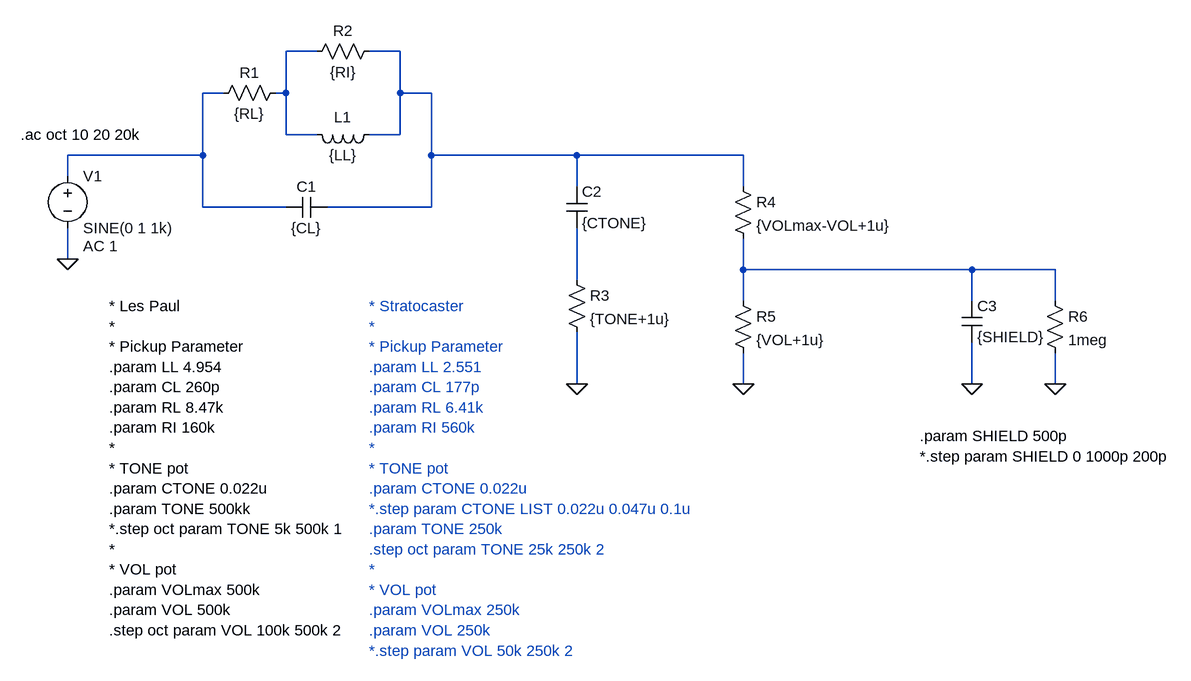
[diagram p0: schematic Pickup.asc]
Pickup.asc, the LTspice schematic file:
Version 4
SHEET 1 1312 1076
WIRE -80 -112 -128 -112
WIRE 48 -112 0 -112
WIRE -224 -48 -256 -48
WIRE -128 -48 -128 -112
WIRE -128 -48 -144 -48
WIRE 48 -48 48 -112
WIRE 96 -48 48 -48
WIRE -128 16 -128 -48
WIRE -80 16 -128 16
WIRE 48 16 48 -48
WIRE 48 16 0 16
WIRE -256 48 -256 -48
WIRE -256 48 -464 48
WIRE 96 48 96 -48
WIRE 320 48 96 48
WIRE 576 48 320 48
WIRE -464 80 -464 48
WIRE 320 96 320 48
WIRE 576 96 576 48
WIRE -256 128 -256 48
WIRE -128 128 -256 128
WIRE 96 128 96 48
WIRE 96 128 -64 128
WIRE -464 208 -464 160
WIRE 576 224 576 176
WIRE 928 224 576 224
WIRE 1056 224 928 224
WIRE 320 240 320 160
WIRE 576 272 576 224
WIRE 928 272 928 224
WIRE 1056 272 1056 224
WIRE 320 400 320 320
WIRE 576 400 576 352
WIRE 928 400 928 336
WIRE 1056 400 1056 352
FLAG -464 208 0
FLAG 320 400 0
FLAG 576 400 0
FLAG 1056 400 0
FLAG 928 400 0
SYMBOL res -128 -64 R90
WINDOW 0 0 56 VBottom 2
WINDOW 3 32 56 VTop 2
SYMATTR InstName R1
SYMATTR Value {RL}
SYMBOL res 16 -128 R90
WINDOW 0 0 56 VBottom 2
WINDOW 3 32 56 VTop 2
SYMATTR InstName R2
SYMATTR Value {RI}
SYMBOL ind 16 0 R90
WINDOW 0 5 56 VBottom 2
WINDOW 3 32 56 VTop 2
SYMATTR InstName L1
SYMATTR Value {LL}
SYMBOL cap -64 112 R90
WINDOW 0 0 32 VBottom 2
WINDOW 3 32 32 VTop 2
SYMATTR InstName C1
SYMATTR Value {CL}
SYMBOL voltage -464 64 R0
WINDOW 123 24 124 Left 2
WINDOW 39 0 0 Left 2
SYMATTR Value2 AC 1
SYMATTR InstName V1
SYMATTR Value SINE(0 1 1k)
SYMBOL res 304 224 R0
SYMATTR InstName R3
SYMATTR Value {TONE+1u}
SYMBOL cap 304 96 R0
SYMATTR InstName C2
SYMATTR Value {CTONE}
SYMBOL res 560 80 R0
SYMATTR InstName R4
SYMATTR Value {VOLmax-VOL+1u}
SYMBOL res 560 256 R0
SYMATTR InstName R5
SYMATTR Value {VOL+1u}
SYMBOL cap 912 272 R0
SYMATTR InstName C3
SYMATTR Value {SHIELD}
SYMBOL res 1040 256 R0
SYMATTR InstName R6
SYMATTR Value 1meg
TEXT -536 16 Left 2 !.ac oct 10 20 20k
TEXT 848 480 Left 2 !.param SHIELD 500p\n*.step param SHIELD 0 1000p 200p
TEXT 0 280 Left 2 ;* Stratocaster\n*\n* Pickup Parameter\n.param LL 2.551\n.param CL 177p\n.param RL 6.41k\n.param RI 560k\n*\n* TONE pot\n.param CTONE 0.022u\n*.step param CTONE LIST 0.022u 0.047u 0.1u\n.param TONE 250k\n.step oct param TONE 25k 250k 2\n*\n* VOL pot\n.param VOLmax 250k\n.param VOL 250k\n*.step param VOL 50k 250k 2
TEXT -400 280 Left 2 !* Les Paul\n*\n* Pickup Parameter\n.param LL 4.954\n.param CL 260p\n.param RL 8.47k\n.param RI 160k\n*\n* TONE pot\n.param CTONE 0.022u\n.param TONE 500kk\n*.step oct param TONE 5k 500k 1\n*\n* VOL pot\n.param VOLmax 500k\n.param VOL 500k\n.step oct param VOL 100k 500k 2

The netlist it stands for:
* Pickup.asc
R1 N001 N003 {RL}
R2 N002 N001 {RI}
L1 N002 N001 {LL}
C1 N002 N003 {CL}
V1 N003 0 SINE(0 1 1k) AC 1
R3 N005 0 {TONE+1u}
C2 N002 N005 {CTONE}
R4 N002 N004 {VOLmax-VOL+1u}
R5 N004 0 {VOL+1u}
C3 N004 0 {SHIELD}
R6 N004 0 1meg
.ac oct 10 20 20k
.param SHIELD 500p
*.step param SHIELD 0 1000p 200p
* * Stratocaster
* *
* * Pickup Parameter
* .param LL 2.551
* .param CL 177p
* .param RL 6.41k
* .param RI 560k
* *
* * TONE pot
* .param CTONE 0.022u
* *.step param CTONE LIST 0.022u 0.047u 0.1u
* .param TONE 250k
* .step oct param TONE 25k 250k 2
* *
* * VOL pot
* .param VOLmax 250k
* .param VOL 250k
* *.step param VOL 50k 250k 2
* Les Paul
*
* Pickup Parameter
.param LL 4.954
.param CL 260p
.param RL 8.47k
.param RI 160k
*
* TONE pot
.param CTONE 0.022u
.param TONE 500kk
*.step oct param TONE 5k 500k 1
*
* VOL pot
.param VOLmax 500k
.param VOL 500k
.step oct param VOL 100k 500k 2
.backanno
.end